# EAGLE schematic OnOnfre_dual_parafuso_ssr (EAGLE 9.1.3)
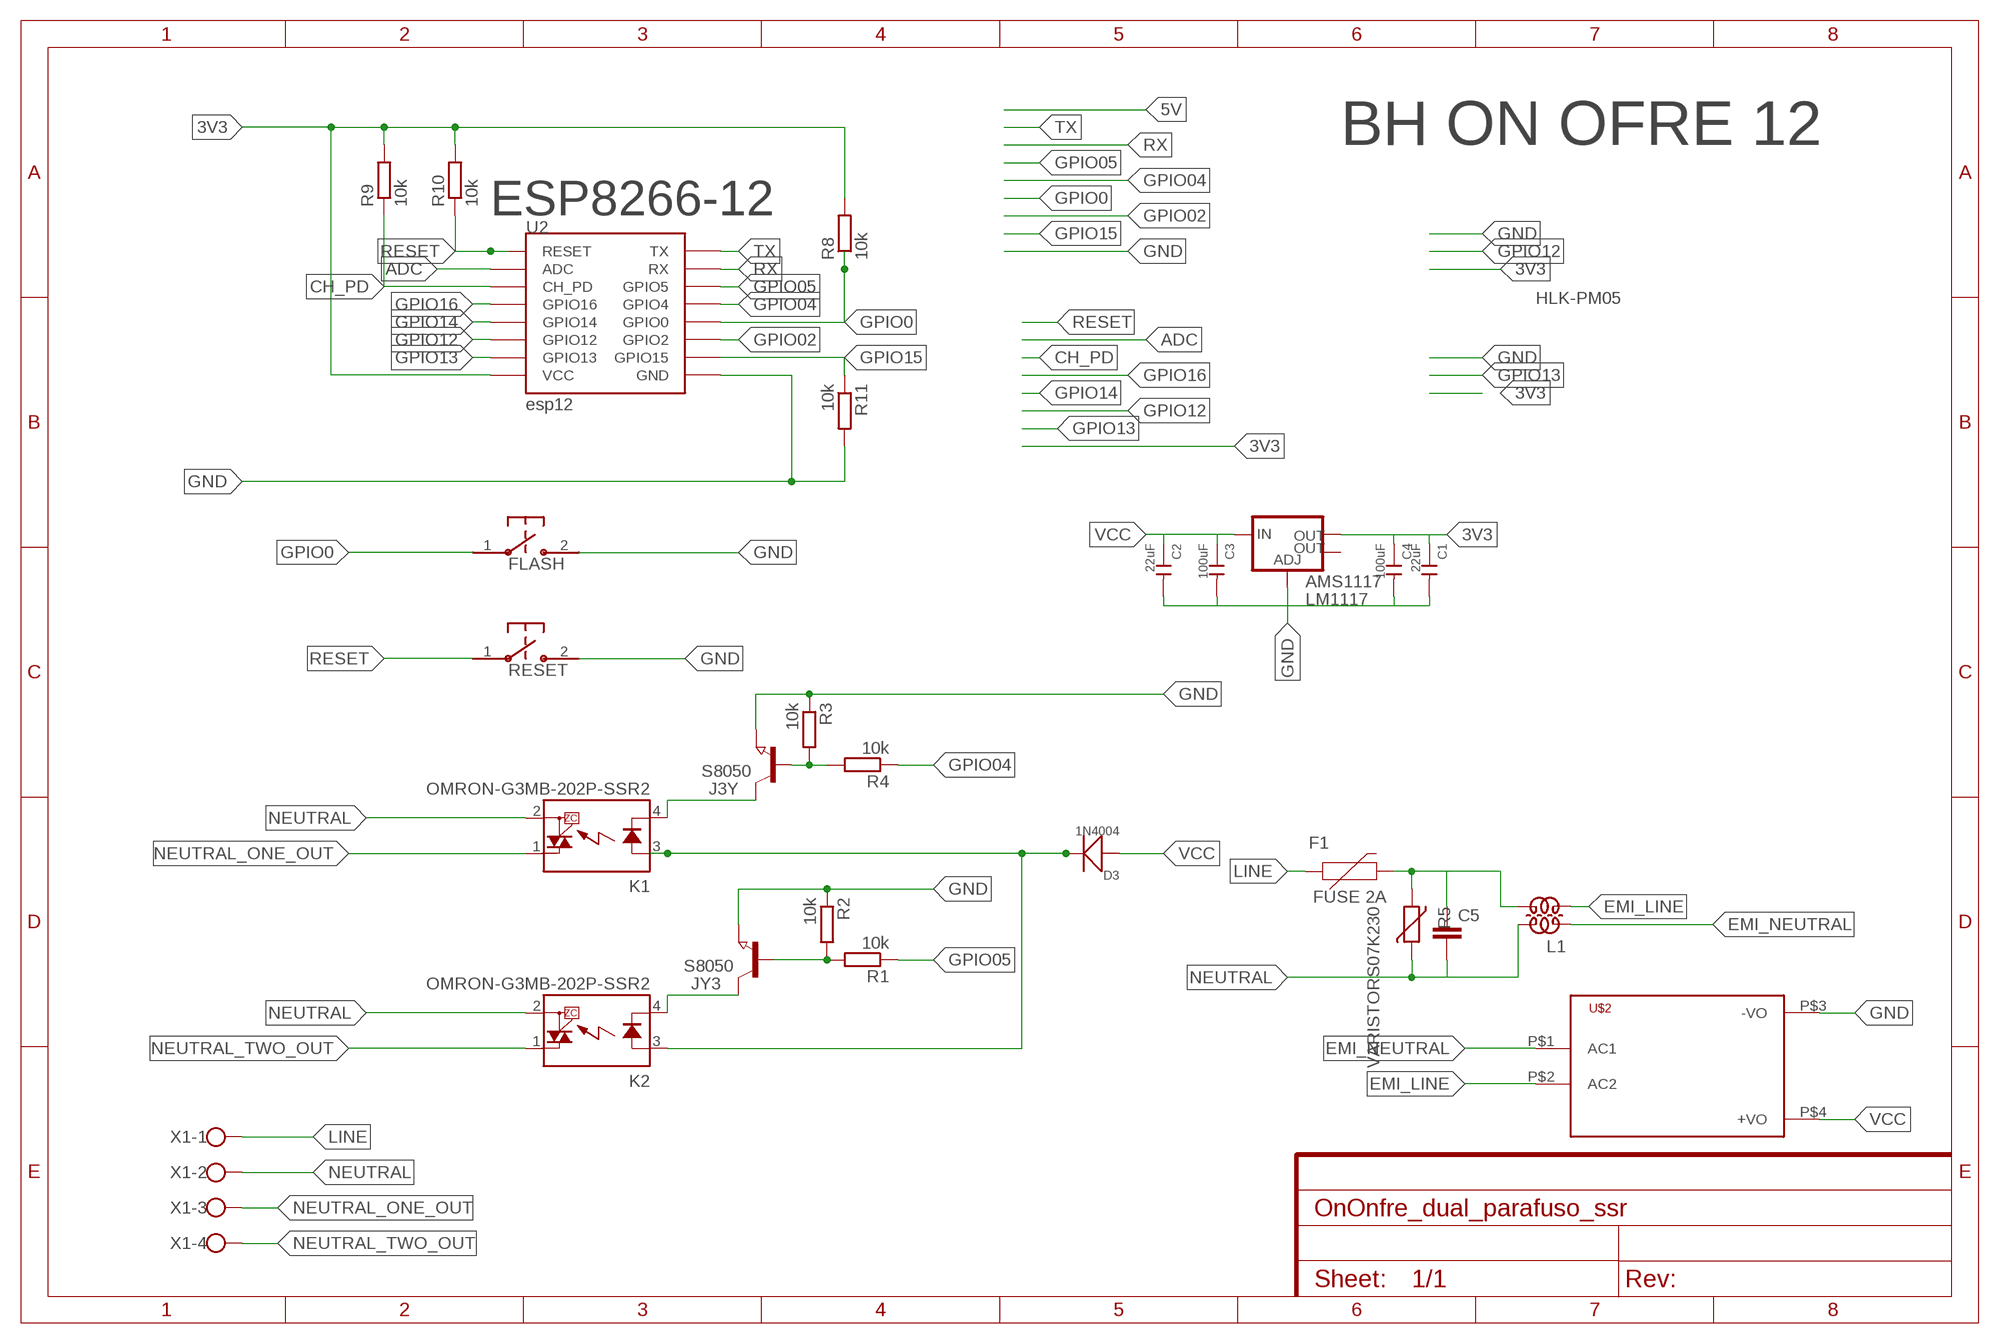
[diagram p0: schematic, sheet 1]

## Parts
AMS1117  LM1117  V_REG_LM1117SOT223  [SOT223]
C1  22uF  CERAMIC-1NF-1KV-10%-X7R(1206)  [C1206]
C2  22uF  CERAMIC-1NF-1KV-10%-X7R(1206)  [C1206]
C3  100uF  CERAMIC-1NF-1KV-10%-X7R(1206)  [C1206]
C4  100uF  CERAMIC-1NF-1KV-10%-X7R(1206)  [C1206]
C5  C-EU102-054X133  [C102-054X133]
D3  1N4004  DIODE-GEN-PURPOSE-1KV-1A(DO-214AC)  [DO-214AC]
F1  FUSE 2A  PPTC_PTH  [PTH]
FLASH  B3U-1000P-2P-SMD  B3U-1000P  [B3U-1000P]
J3Y  S8050  NPN-TRANSISTOR_SOT23  [SOT23]
JY3  S8050  NPN-TRANSISTOR_SOT23  [SOT23]
K1  OMRON-G3MB-202P-SSR2  [OMRON-G3MB-202P-SSR]
K2  OMRON-G3MB-202P-SSR2  [OMRON-G3MB-202P-SSR]
L1  ZD60820510  [ZD6-2X15]
R1  10k  R-EU_R0603  [R0603]
R2  10k  R-EU_R0603  [R0603]
R3  10k  R-EU_R0603  [R0603]
R4  10k  R-EU_R0603  [R0603]
R5  VARISTORS07K230  [S07K230]
R8  10k  R-EU_R0603  [R0603]
R9  10k  R-EU_R0603  [R0603]
R10  10k  R-EU_R0603  [R0603]
R11  10k  R-EU_R0603  [R0603]
RESET  B3U-1000P-2P-SMD  B3U-1000P  [B3U-1000P]
U2  esp12  ESP12SMD  [ESP12-SMD]
U$2  HKLPM01  [HKLPM01]
X1  W237-4  [W237-4]

## Nets
3V3: AMS1117.2(OUT) C1.1 C4.1 R8.2 R9.2 R10.2 U2.VCC
5V: D3.2(-) K1.3(A) K2.3(A)
ADC: U2.ADC
CH_PD: R9.1 U2.CH_PD
EMI_LINE: L1.2 U$2.P$2(AC2)
EMI_NEUTRAL: L1.1 U$2.P$1(AC1)
GND: AMS1117.1(ADJ) C1.2 C2.2 C3.2 C4.2 FLASH.2 J3Y.2(E) JY3.2(E) R2.1 R3.1 R11.2 RESET.2 U2.GND U$2.P$3(-VO)
GPIO0: FLASH.1 R8.1 U2.GPIO0
GPIO02: U2.GPIO2
GPIO04: R4.1 U2.GPIO4
GPIO05: R1.1 U2.GPIO5
GPIO12: U2.GPIO12
GPIO13: U2.GPIO13
GPIO14: U2.GPIO14
GPIO15: R11.1 U2.GPIO15
GPIO16: U2.GPIO16
LINE [220V]: F1.P$1 X1.1
N$1: J3Y.3(C) K1.4(K)
N$2: C5.1 F1.P$2 L1.3 R5.2
N$7: J3Y.1(B) R3.2 R4.2
N$9: JY3.3(C) K2.4(K)
N$13: JY3.1(B) R1.2 R2.2
NEUTRAL [220V]: C5.2 K1.2(DS2) K2.2(DS2) L1.4 R5.1 X1.2
NEUTRAL_ONE_OUT [220V]: K1.1(DS1) X1.3
NEUTRAL_TWO_OUT [220V]: K2.1(DS1) X1.4
RESET: R10.1 RESET.1 U2.RESET
RX: U2.RXD0(RX)
TX: U2.TXD0(TX)
VCC: AMS1117.3(IN) C2.1 C3.1 D3.1(+) U$2.P$4(+VO)
Unconnected: AMS1117.4(OUT)

## Notes on the sheet
- BH ON OFRE 12
- ESP8266-12
- HLK-PM05

## Library data of the parts
AMS1117 = SparkFun-IC-Power:V_REG_LM1117: Voltage Regulator LM1117 Standard adjustable voltage regulator but in SMD form. Spark Fun Electronics SKU : COM-00595; PROD_ID: VREG-08170
C1-C4 = Seeed-Capacitor:CERAMIC-1NF-1KV-10%-X7R?(1206): 302010189; MPN: CC1206KKX7RCBB102; VALUE: 1NF
C5 = rcl:C-EU: CAPACITOR, European symbol; SPICEPREFIX: C
D3 = Seeed-Diode:DIODE-GEN-PURPOSE-1KV-1A(DO-214AC): 304010013; MPN: 1N4007; VALUE: 1N4007
F1 = SparkFun-Fuses:PPTC: Resettable Fuse PPTC Resettable Fuse. Really a sort of resistor with a polymeric positive temperature coefficient whose resistance increases dramatically with an increase in temperature. When heated by the power passing through the resistance rises causing the current to be limited, protecting the circuit. This is achieved by the transition of the polymer from a crystalline to an amorphous state where the conductive carbon separates breaking the conductive pathways found in the cool crystalline structure. When a PPTC cools back down it resumes conducting letting the circuit turn back on. SparkFun Products: SparkFun RedBoard - Programmed with Arduino <https://www.sparkfun.com/products/12757> Pro Micro - 5V/16MHz <https://www.sparkfun.com/products/12640> Arduino Pro 328 - 5V/16MHz <https://www.sparkfun.com/products/10915> MP3 Trigger <https://www.sparkfun.com/products/13720>; PROD_ID: RES-08490; VALUE: 72V/0.25A
FLASH RESET = switches:B3U: Switch; DIGIKEY: SW1020CT-ND; MANUFACTURER: Omron; MPN: B3U-1000P
J3Y JY3 = semicon-smd-ipc:NPN-TRANSISTOR_: NPN TRANSISTOR
K1 K2 = Omron G3MB 202p SSR:OMRON-G3MB-202P-SSR: IT(rms) 8A, Zero Cross type SIP 4pin Triac output SSR Source: http://sharp-world.com/products/device/lineup/data/pdf/datasheet/s102s02_e.pdf; MPN: S202S02F; OC_FARNELL: 1618475; OC_NEWARK: 14N9588
L1 = inductor-neosid:ZD60820510: WIDE-BAND CHOKE 2 x 1.5 windings; OC_FARNELL: unknown; OC_NEWARK: unknown
R1-R4 R8-R11 = resistor:R-EU_: RESISTOR, European symbol
R5 = varistor:VARISTOR: VARISTOR
U2 = esp8266modules:ESP12: ESP8266 Wifi module 12
U$2 = HKLPM01:HKLPM01
X1 = con-wago-500:W237-4: WAGO SCREW CLAMP; OC_FARNELL: unknown; OC_NEWARK: unknown

## Net classes
1 220V: width 1.27 mm, clearance 2 mm